# EAGLE design LogicShrimp-v1.0b (EAGLE 5.11)
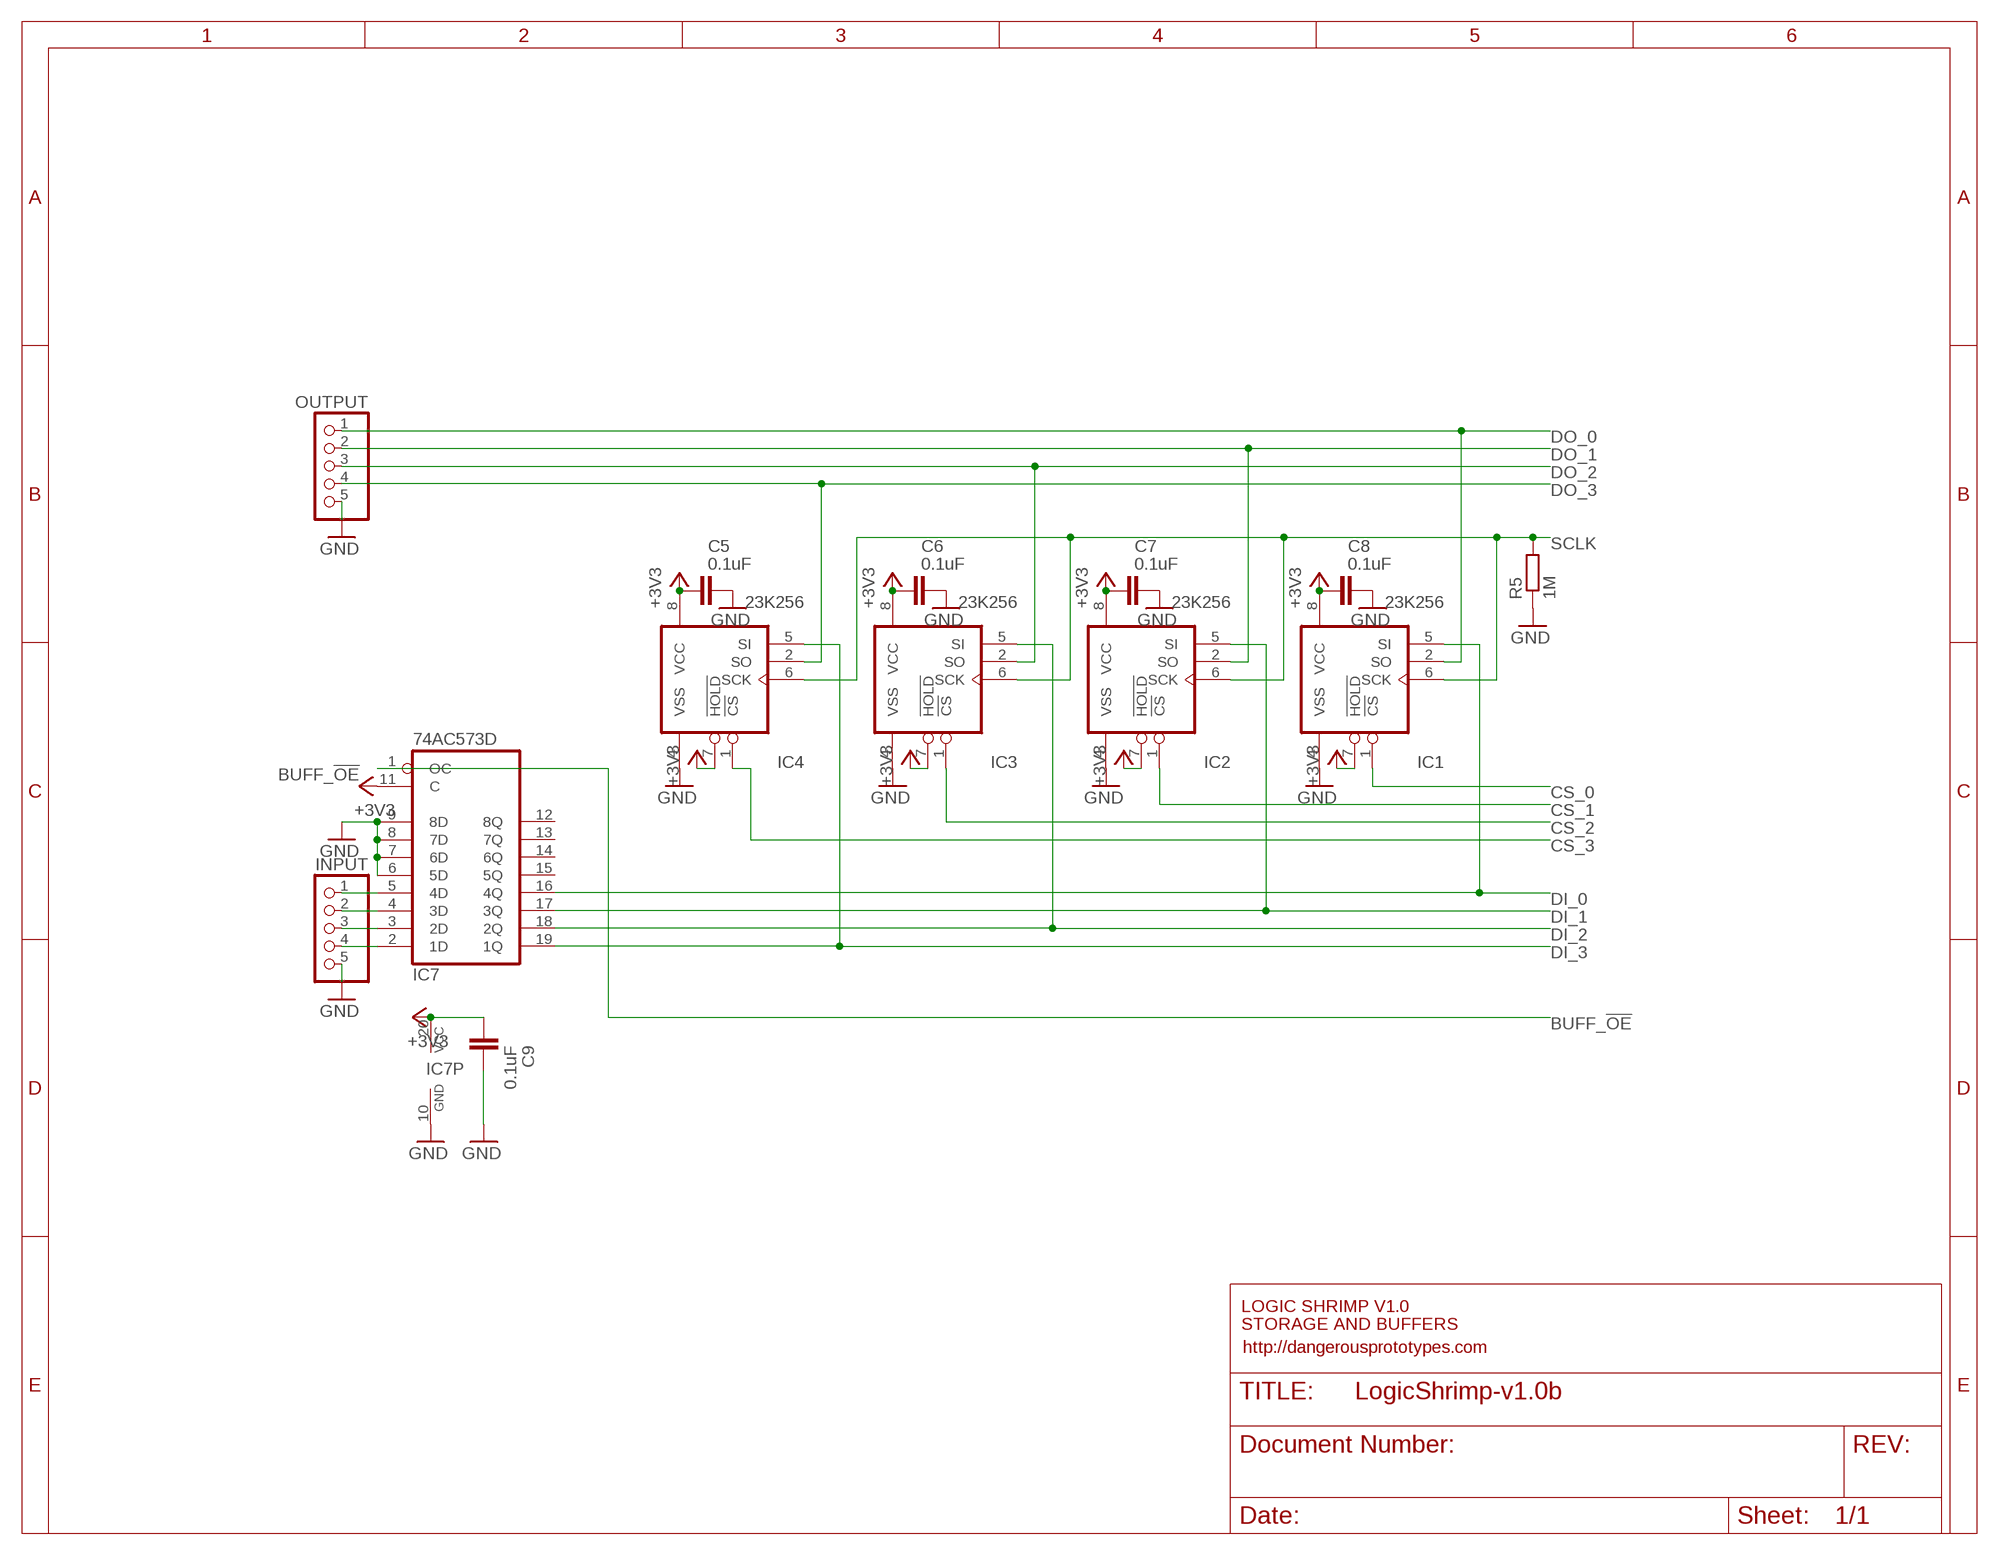
[diagram p0: schematic, sheet 1, part 1 of 2]
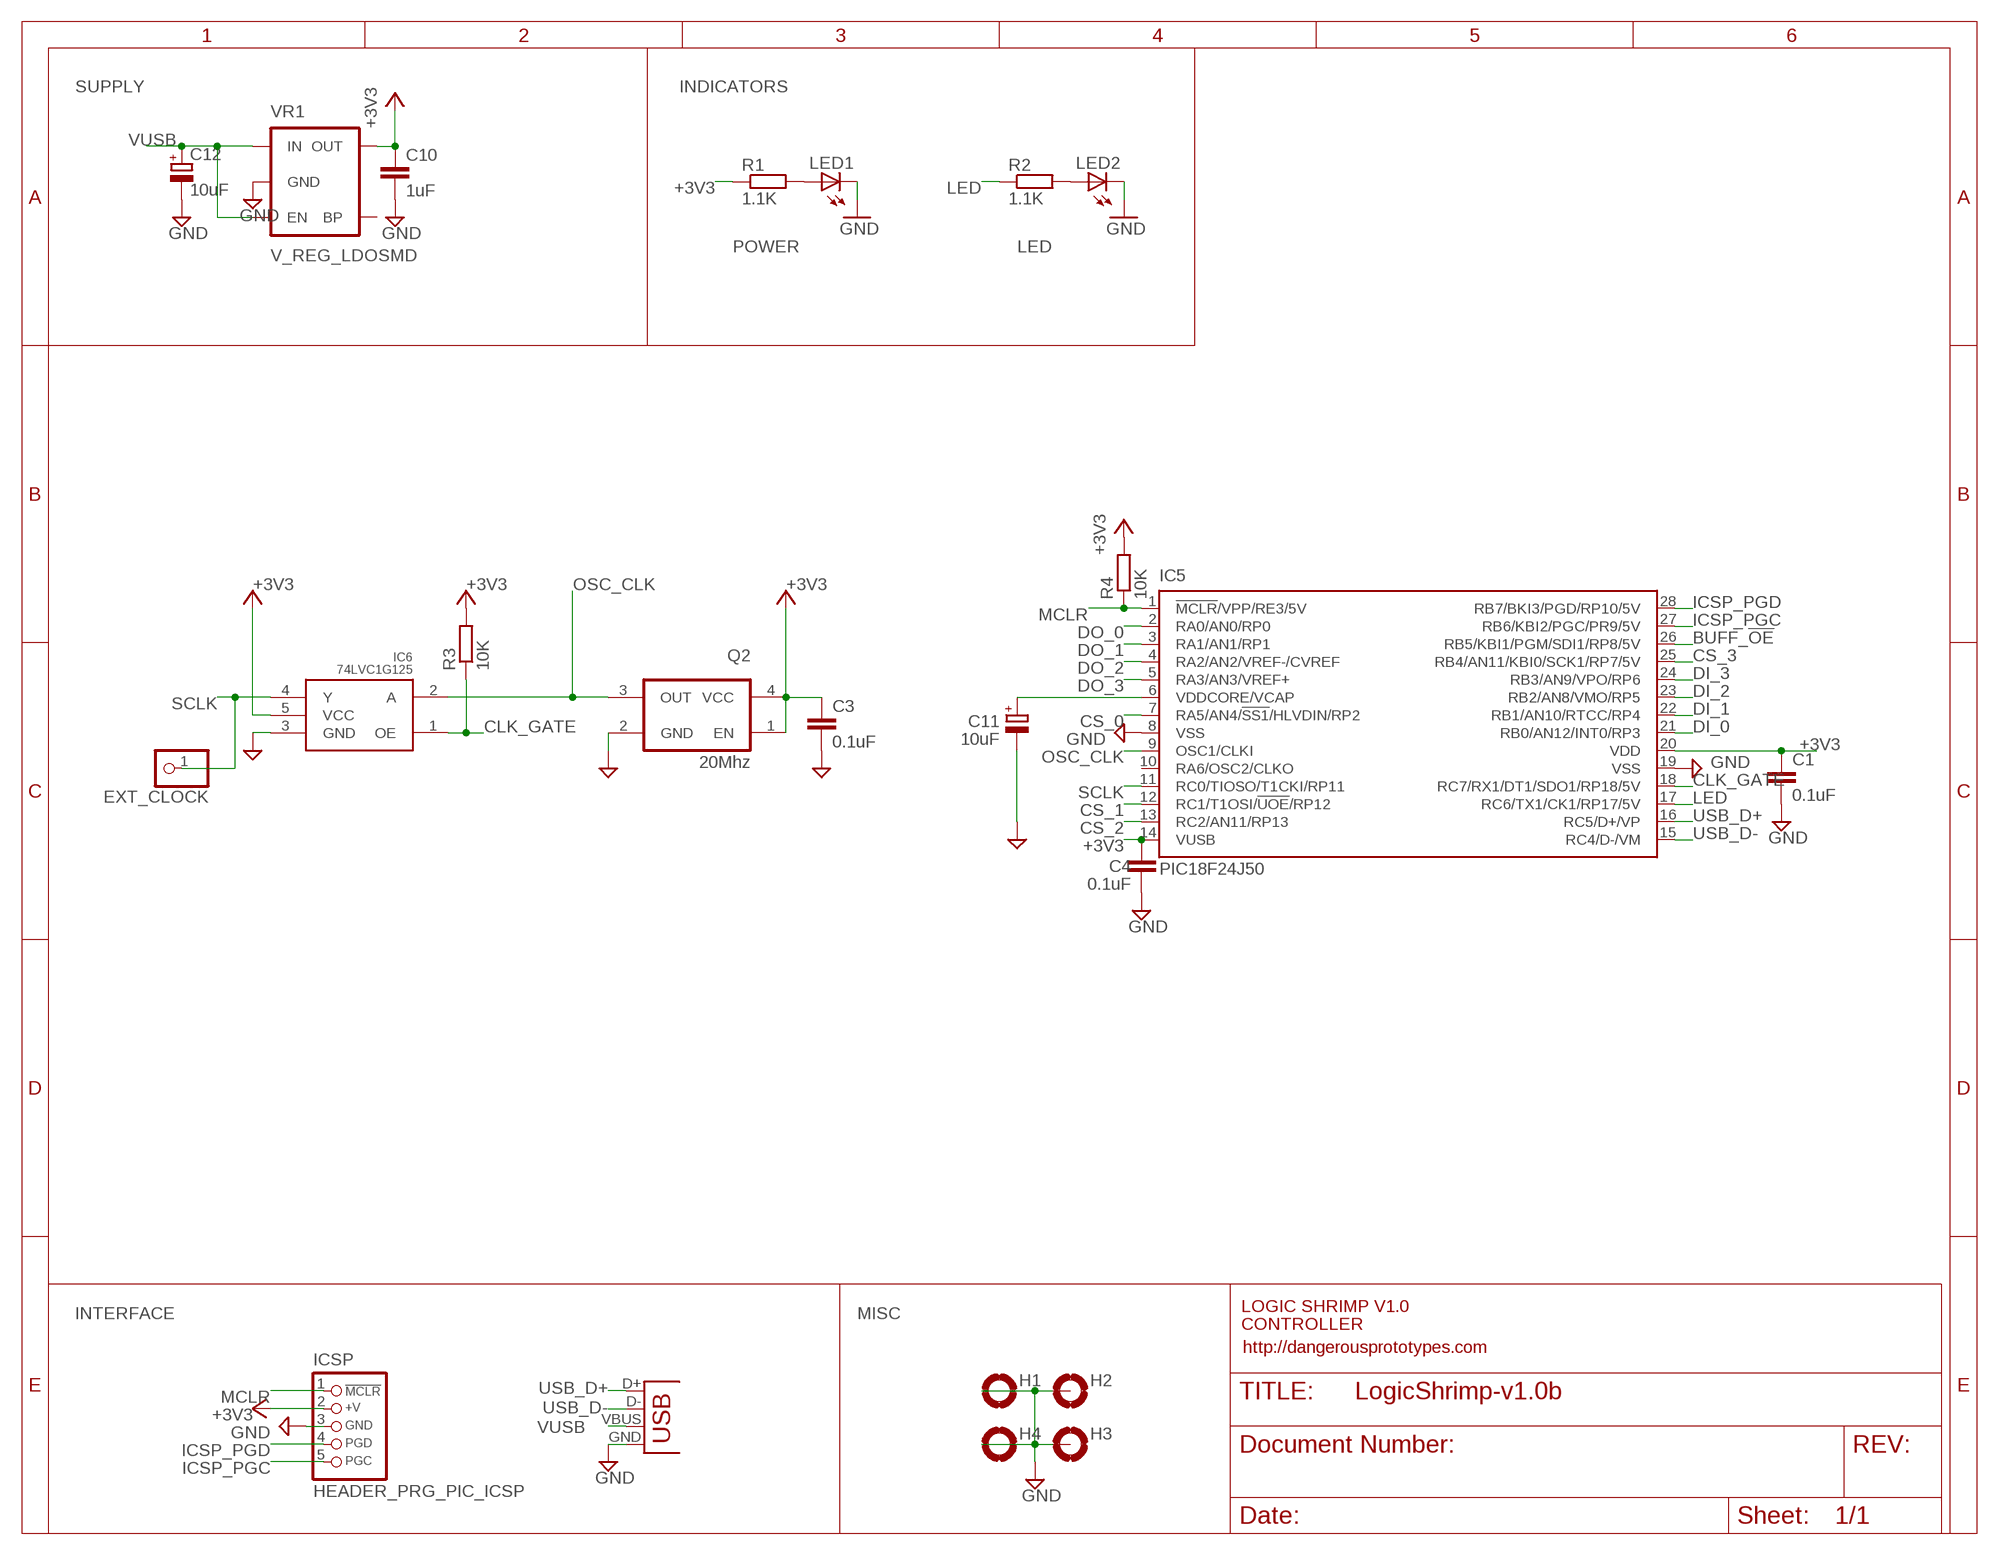
[diagram p1: schematic, sheet 1, part 2 of 2]

## Parts
C1  0.1uF  C-EUC0603  [C0603]
C3  0.1uF  C-EUC0603  [C0603]
C4  0.1uF  C-EUC0603  [C0603]
C5  0.1uF  C-EUC0603  [C0603]
C6  0.1uF  C-EUC0603  [C0603]
C7  0.1uF  C-EUC0603  [C0603]
C8  0.1uF  C-EUC0603  [C0603]
C9  0.1uF  C-EUC0603  [C0603]
C10  1uF  C-EUC0603  [C0603]
C11  10uF  CPOL-EUSMCA  [SMC_A]
C12  10uF  CPOL-EUSMCA  [SMC_A]
EXT_CLOCK  PINHD-1X1  [1X01]
H1  MOUNT-PAD-ROUND2.8  [2,8-PAD]
H2  MOUNT-PAD-ROUND2.8  [2,8-PAD]
H3  MOUNT-PAD-ROUND2.8  [2,8-PAD]
H4  MOUNT-PAD-ROUND2.8  [2,8-PAD]
IC1  23K256  [SOIC8]
IC2  23K256  [SOIC8]
IC3  23K256  [SOIC8]
IC4  23K256  [SOIC8]
IC5  PIC18F24J50  PIC18FJ2X50SSOP  [SSOP28]
IC6  74LVC1G125  [SOT-23-5]
IC7  74AC573D  [SO20W]
ICSP  HEADER_PRG_PIC_ICSP  [HEADER_PRG_1X05]
INPUT  PINHD-1X05_2.54-S  [1X05-S]
LED1  LED805  [LED-805]
LED2  LED805  [LED-805]
OUTPUT  PINHD-1X05_2.54-S  [1X05-S]
Q2  20Mhz  OSCILLATOR  [OSCILLATOR_7X5_SMD]
R1  1.1K  R-EU_R0603  [R0603]
R2  1.1K  R-EU_R0603  [R0603]
R3  10K  R-EU_R0603  [R0603]
R4  10K  R-EU_R0603  [R0603]
R5  1M  R-EU_R0603  [R0603]
USB  USBSMD  [USB-MINIB]
VR1  V_REG_LDOSMD  [SOT23-5]

## Nets
+3V3: C1.1 C3.1 C4.1 C5.1 C6.2 C7.2 C8.2 C9.1 C10.1 IC1.7(!HOLD) IC1.8(VCC) IC2.7(!HOLD) IC2.8(VCC) IC3.7(!HOLD) IC3.8(VCC) IC4.7(!HOLD) IC4.8(VCC) IC5.14(VUSB) IC5.20(VDD) IC6.5(VCC) IC7.11(C) IC7.20(VCC) ICSP.2(+V) Q2.1(EN) Q2.4(VCC) R1.1 R3.2 R4.2 VR1.5(OUT)
BUFF_!OE: IC5.26(RB5/KBI1/PGM/SDI1/RP8/5V) IC7.1(OC)
CLK_GATE: IC5.18(RC7/RX1/DT1/SDO1/RP18/5V) IC6.1(OE) R3.1
CS_0: IC1.1(!CS) IC5.7(RA5/AN4/!SS1!/HLVDIN/RP2)
CS_1: IC2.1(!CS) IC5.12(RC1/T1OSI/!UOE!/RP12)
CS_2: IC3.1(!CS) IC5.13(RC2/AN11/RP13)
CS_3: IC4.1(!CS) IC5.25(RB4/AN11/KBI0/SCK1/RP7/5V)
DI_0: IC1.5(SI) IC5.21(RB0/AN12/INT0/RP3) IC7.16(4Q)
DI_1: IC2.5(SI) IC5.22(RB1/AN10/RTCC/RP4) IC7.17(3Q)
DI_2: IC3.5(SI) IC5.23(RB2/AN8/VMO/RP5) IC7.18(2Q)
DI_3: IC4.5(SI) IC5.24(RB3/AN9/VPO/RP6) IC7.19(1Q)
DO_0: IC1.2(SO) IC5.2(RA0/AN0/RP0) OUTPUT.1
DO_1: IC2.2(SO) IC5.3(RA1/AN1/RP1) OUTPUT.2
DO_2: IC3.2(SO) IC5.4(RA2/AN2/VREF-/CVREF) OUTPUT.3
DO_3: IC4.2(SO) IC5.5(RA3/AN3/VREF+) OUTPUT.4
GND: C1.2 C3.2 C4.2 C5.2 C6.1 C7.1 C8.1 C9.2 C10.2 C11.- C12.- H1.B2,8(MOUNT) H2.B2,8(MOUNT) H3.B2,8(MOUNT) H4.B2,8(MOUNT) IC1.4(VSS) IC2.4(VSS) IC3.4(VSS) IC4.4(VSS) IC5.8(VSS) IC5.19(VSS) IC6.3(GND) IC7.6(5D) IC7.7(6D) IC7.8(7D) IC7.9(8D) IC7.10(GND) ICSP.3(GND) INPUT.5 LED1.C LED2.C OUTPUT.5 Q2.2(GND) R5.1 USB.GND VR1.2(GND)
ICSP_PGC: IC5.27(RB6/KBI2/PGC/PR9/5V) ICSP.5(PGC)
ICSP_PGD: IC5.28(RB7/BKI3/PGD/RP10/5V) ICSP.4(PGD)
LED: IC5.17(RC6/TX1/CK1/RP17/5V) R2.1
MCLR: IC5.1(!MCLR!/VPP/RE3/5V) ICSP.1(/MCLR) R4.1
N$2: IC7.5(4D) INPUT.1
N$3: IC7.4(3D) INPUT.2
N$4: IC7.3(2D) INPUT.3
N$5: IC7.2(1D) INPUT.4
N$6: C11.+ IC5.6(VDDCORE/VCAP)
N$7: LED1.A R1.2
N$8: LED2.A R2.2
OSC_CLK: IC5.9(OSC1/CLKI) IC6.2(A) Q2.3(OUT)
SCLK: EXT_CLOCK.1 IC1.6(SCK) IC2.6(SCK) IC3.6(SCK) IC4.6(SCK) IC5.11(RC0/TIOSO/T1CKI/RP11) IC6.4(Y) R5.2
USB_D+: IC5.16(RC5/D+/VP) USB.D+
USB_D-: IC5.15(RC4/D-/VM) USB.D-
VUSB: C12.+ USB.VBUS VR1.1(IN) VR1.3(EN)
Unconnected: IC5.10(RA6/OSC2/CLKO) IC7.12(8Q) IC7.13(7Q) IC7.14(6Q) IC7.15(5Q) VR1.4(BP)

## Notes on the sheet
- SUPPLY | INDICATORS
- POWER | LED
- LOGIC SHRIMP V1.0 | LOGIC SHRIMP V1.0
- INTERFACE | MISC
- STORAGE AND BUFFERS | CONTROLLER
- http://dangerousprototypes.com | http://dangerousprototypes.com

## Library data of the parts
C1 C4 C10 = resistor:C-EU: CAPACITOR, European symbol
C3 C5-C9 = rcl:C-EU: CAPACITOR, European symbol
C11 C12 = rcl:CPOL-EU: POLARIZED CAPACITOR, European symbol
EXT_CLOCK = pinhead-2:PINHD-1X1: PIN HEADER
H1-H4 = holes:MOUNT-PAD-ROUND: MOUNTING PAD, round
IC1-IC4 = dp_devices:23K256: 256K SPI Bus Low power Serial SRAM
IC5 = dp_devices:PIC18FJ2X50; PIC18FJ2X50: PIC18FJ2X50
IC6 = dp_devices:74LVC1G125
IC7 = 74xx-eu:74*573: 8-bit D latch BUS DRIVER
ICSP = dp_devices:HEADER_PRG_PIC_ICSP: 5-pin PIC In Circuit Serial Programming header
INPUT OUTPUT = pinhead-2:PINHD-1X05: PIN HEADER
LED1 LED2 = dp_devices:LED
Q2 = dp_devices:OSCILLATOR: Oscillator
R1-R5 = resistor:R-EU_: RESISTOR, European symbol
USB = SparkFun:USB: USB Connectors USB-B-PTH is fully proven SKU : PRT-00139 USB-miniB is fully proven SKU : PRT-00587 USB-A-PCB is untested. USB-A-H is throughly reviewed, but untested. Spark Fun Electronics SKU : PRT-00437 USB-B-SMT is throughly reviewed, but untested. Needs silkscreen touching up. USB-A-S has not been used/tested USB-MB-H has not been used/tested
VR1 = SparkFun:V_REG_LDO: Voltage Regulator LDO Standard 150mA LDO voltage regulator in SOT-23 layout. Micrel part MIC5205. BP (by-pass) pin is used to lower output noise with 470pF cap.

## Board
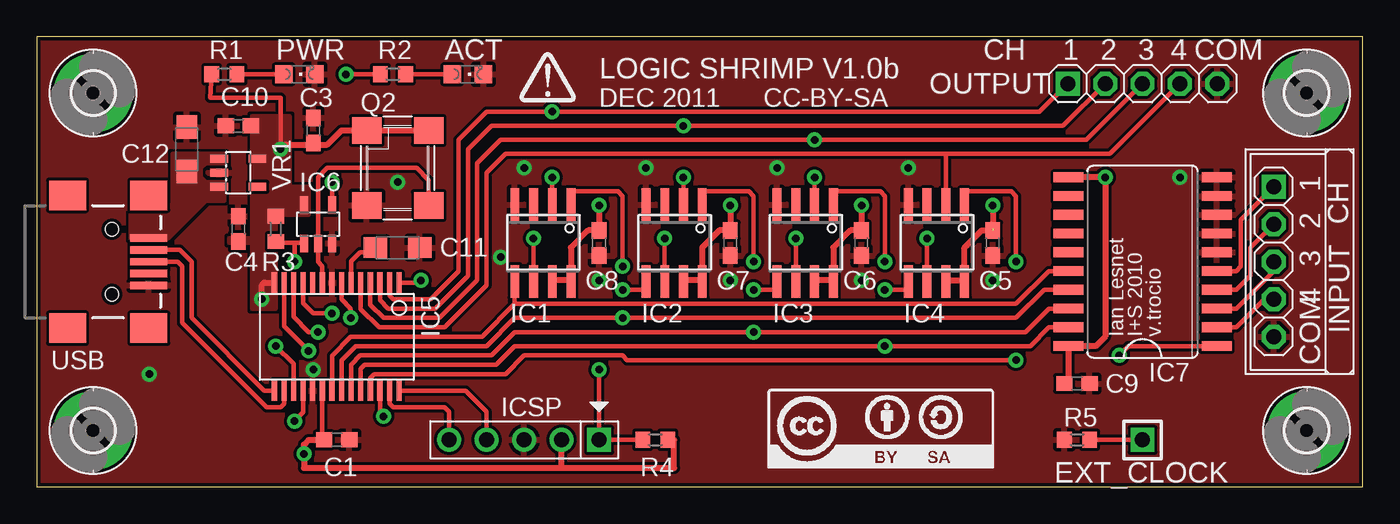
[diagram p2: board, top side]
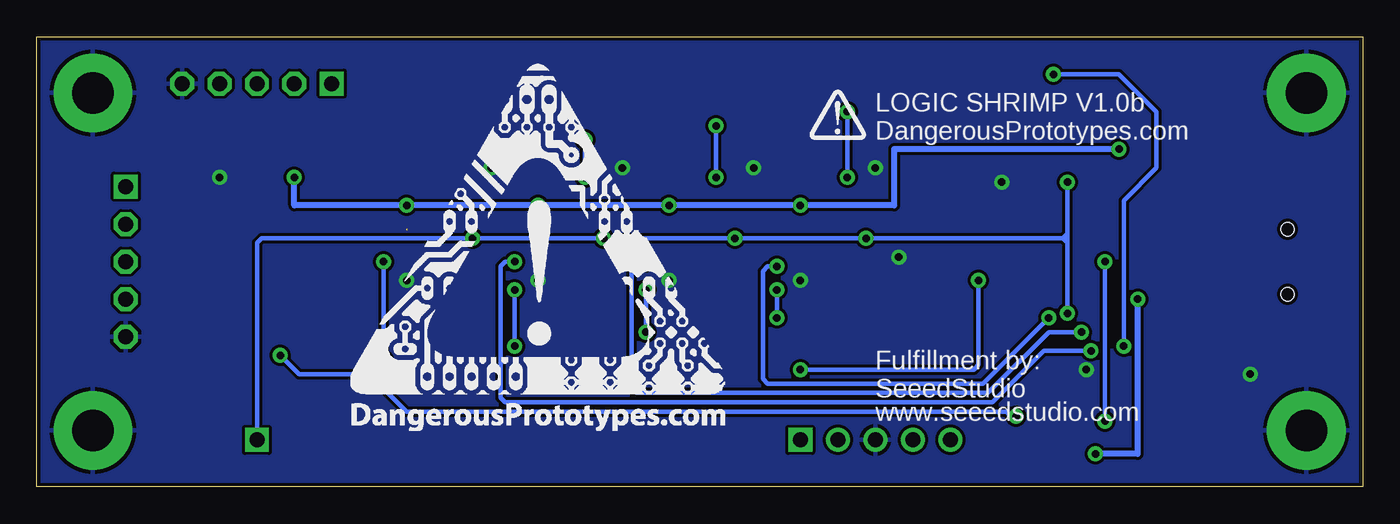
[diagram p3: board, bottom side, seen from below]

Size 89.84 x 30.47 mm. Coordinates in mm from the lower left corner, seen from the top.
Outline: 0,0 89.84,0 89.84,30.47 0,30.47 0,0
Copper layers (1*16): Top 0.035mm / dielectric 1.5mm / Bottom 0.035mm
Design rules "SparkFun": minimum track width 8mil, minimum drill 20mil, track to track 8mil, track to pad 8mil, pad to pad 8mil, via to via 8mil, smd to smd 8mil, copper to edge 10mil, drill to drill 8mil, minimum pad ring 12mil, minimum via ring 10mil, stop-mask expansion 4mil, vias tented up to drill 25mil, thermal gap 10mil

### Footprints (pad centres in the part's own frame; a part is rotated, then mirrored left to right if it is on the bottom)
C0603 = smd 1.1 x 1: 1 -0.85,0; 2 0.85,0
SMC_A = smd 1.6 x 1.4: + -1.5,0; - 1.5,0
1X01 = drill 1.016 square: 1 0,0
2,8-PAD = drill 2.8 pad 5.334 round: B2,8 0,0
SOIC8 = smd 0.6 x 2.2: 1 -1.905,-2.6; 2 -0.635,-2.6; 3 0.635,-2.6; 4 1.905,-2.6; 5 1.905,2.6; 6 0.635,2.6; 7 -0.635,2.6; 8 -1.905,2.6
SSOP28 = smd 0.348 x 1.397: 1 -4.225,-3.656; 2 -3.575,-3.656; 3 -2.925,-3.656; 4 -2.275,-3.656; 5 -1.625,-3.656; 6 -0.975,-3.656; 7 -0.325,-3.656; 8 0.325,-3.656; 9 0.975,-3.656; 10 1.625,-3.656; 11 2.275,-3.656; 12 2.925,-3.656; 13 3.575,-3.656; 14 4.225,-3.656; 15 4.225,3.656; 16 3.575,3.656; 17 2.925,3.656; 18 2.275,3.656; 19 1.625,3.656; 20 0.975,3.656; 21 0.325,3.656; 22 -0.325,3.656; 23 -0.975,3.656; 24 -1.625,3.656; 25 -2.275,3.656; 26 -2.925,3.656; 27 -3.575,3.656; 28 -4.225,3.656
SOT-23-5 = smd 0.55 x 1.2: 1 -0.95,-1.3; 2 0,-1.3; 3 0.95,-1.3; 4 0.95,1.3; 5 -0.95,1.3
SO20W = smd 0.66 x 2.032: 1 -5.715,-5.029; 2 -4.445,-5.029; 3 -3.175,-5.029; 4 -1.905,-5.029; 5 -0.635,-5.029; 6 0.635,-5.029; 7 1.905,-5.029; 8 3.175,-5.029; 9 4.445,-5.029; 10 5.715,-5.029; 11 5.715,5.029; 12 4.445,5.029; 13 3.175,5.029; 14 1.905,5.029; 15 0.635,5.029; 16 -0.635,5.029; 17 -1.905,5.029; 18 -3.175,5.029; 19 -4.445,5.029; 20 -5.715,5.029
HEADER_PRG_1X05 = drill 1.016 square: 1 -5.08,0 | drill 1.016 round: 2 -2.54,0; 3 0,0; 4 2.54,0; 5 5.08,0
1X05-S = drill 1.016 square: 1 -5.08,0 | drill 1.016 octagon: 2 -2.54,0; 3 0,0; 4 2.54,0; 5 5.08,0
LED-805 = smd 1.2 x 1.2: A 0,-1.05; C 0,1.05
OSCILLATOR_7X5_SMD = smd 1.8 x 2: 1 -2.54,-2.1; 2 2.54,-2.1; 3 2.54,2.1; 4 -2.54,2.1
R0603 = smd 1 x 1.1: 1 -0.85,0; 2 0.85,0
USB-MINIB = smd 2.5 x 0.5: D+ 2.5,0; D- 2.5,0.8; GND 2.5,-1.6; ID 2.5,-0.8; VBUS 2.5,1.6 | smd 2.5 x 2: GND@1 -3,-4.5; GND@2 -3,4.5; GND@3 2.5,4.5; GND@4 2.5,-4.5 | hole 0.9: 0,2.2; 0,-2.2
SOT23-5 = smd 0.55 x 1.2: 1 -0.95,-1.3; 2 0,-1.3; 3 0.95,-1.3; 4 0.95,1.3; 5 -0.95,1.3

### Placement (x,y rotation side)
C1  20.32,3.17 0 top
C3  18.73,24.13 90 top
C4  13.65,17.46 90 top
C5  64.77,16.51 270 top
C6  55.88,16.51 90 top
C7  46.99,16.51 90 top
C8  38.1,16.51 90 top
C9  70.48,6.99 0 top
C10  13.65,24.45 180 top
C11  24.45,16.19 0 top
C12  10.16,22.86 90 top
EXT_CLOCK  74.93,3.17 0 top
H1  3.81,26.67 0 top
H2  86.04,26.67 0 top
H3  86.04,3.81 0 top
H4  3.81,3.81 0 top
IC1  34.29,16.51 180 top
IC2  43.18,16.51 180 top
IC3  52.07,16.51 180 top
IC4  60.96,16.51 180 top
IC5  20.32,10.16 180 top
IC6  19.05,17.78 0 top
IC7  74.93,15.24 90 top
ICSP  33.02,3.17 180 top
INPUT  83.82,15.24 270 top
LED1  17.78,27.94 270 top
LED2  29.21,27.94 270 top
OUTPUT  74.93,27.3 0 top
Q2  24.45,21.59 270 top
R1  12.7,27.94 0 top
R2  24.13,27.94 0 top
R3  16.19,17.46 90 top
R4  41.91,3.17 0 top
R5  70.48,3.17 0 top
U$1  [DP-LOGO_TOP]  32.7,26.04 0 top
U$2  [DP-LOGO-BOTTOM]  33.66,23.49 0 top
U$3  [DP_LOGO_ART_1X1]  68.58,3.81 0 bottom
U$4  [CC-BY-SA]  49.53,1.27 0 top
USB  5.08,15.24 0 top
VR1  13.65,21.27 270 top

### Tracks (layer width: path | path; a pad name or v marks a point on that pad's centre or on a via)
+3V3  (via drill 0.51)  (1 unrouted)
  Top 0.305: IC5.20 19.34,3.3 C1.1 | R1.1 11.75,26.35 16.51,26.35 v16.51,22.86
  Top 0.406: Q2.4 Q2.1 20.64,24.13 19.68,23.18 18.84,23.18 C3.1 18.73,23.18 16.83,23.18 v16.51,22.86 | IC1.8 36.26,13.97 | 34.98,13.97 IC1.7 34.92,13.97 36.13,13.97 IC1.8 | IC2.7 43.81,13.97 45.02,13.97 | IC2.8 45.02,13.97 | IC2.8 45.15,13.97 45.02,13.97 | IC3.7 52.7,13.97 54.03,13.97 IC3.8 53.98,16.19 55.14,17.36 C6.2 v55.88,19.05 | IC4.7 61.59,13.97 62.8,13.97 | 62.8,13.97 IC4.8 | IC4.8 62.92,13.97 62.8,13.97 | IC5.14 15.4,13.82 15.24,13.65 v15.24,12.7 | C1.1 18.41,3.17 18.1,2.86 v18.1,2.22 18.1,1.27 35.56,1.27 | 35.56,1.27 ICSP.2 | R4.2 43.18,3.17 43.18,1.27 35.56,1.27 | IC1.8 36.2,13.97 | IC1.8 36.2,16.19 37.36,17.36 C8.2 v38.1,19.05 | v46.99,19.05 C7.2 46.25,17.36 45.09,16.19 IC2.8 | C5.1 64.03,17.36 62.87,16.19 IC4.8 | v64.77,19.05 64.77,17.46 | IC7.11 v72.39,20.95 72.39,10.16 71.75,9.52 IC7.20 69.9,7.25 C9.1
  Bottom 0.406: v72.39,20.95 72.39,19.05 v64.77,19.05 v55.88,19.05 v46.99,19.05 v38.1,19.05 31.75,19.05 31.75,22.86 v16.51,22.86 | v15.24,12.7 15.24,2.22 v18.1,2.22
  pour Top (no thermals): 14.61,25.08 17.14,25.08 17.14,20.32 18.41,20.32 18.41,18.41 16.19,18.41 16.19,12.06 14.61,12.06 14.61,16.51 13.02,16.51 13.02,16.83 14.61,16.83
BUFF_!OE  (via drill 0.51)
  Top 0.305: IC5.26 23.25,5.01 v23.5,4.76 | IC7.1 73.98,9.52 v73.34,8.89
  Bottom 0.305: v23.5,4.76 23.81,4.76 24.13,5.08 64.77,5.08 67.31,7.62 72.07,7.62 v73.34,8.89
CLK_GATE  (via drill 0.51)
  Top 0.305: IC6.1 18.05,16.43 18.05,16.46 18.1,16.51 17.46,16.51 | 17.46,16.51 16.51,16.51 R3.1 | IC5.18 18.05,5.03 v17.46,4.44 | v17.46,15.24 17.46,16.51
  Bottom 0.305: v17.46,4.44 v17.46,15.24
CS_0  (via drill 0.51)
  Top 0.305: 36.2,19.05 IC1.1 36.2,20 39.37,20 39.69,19.68 v39.69,14.92 | IC5.7 20.64,12.69 21.27,12.06 v21.27,11.43
  Bottom 0.305: v21.27,11.43 25.72,6.99 40.32,6.99 40.64,7.3 40.64,14.61 40.32,14.92 v39.69,14.92
CS_1  (via drill 0.51)
  Top 0.305: 45.09,19.05 IC2.1 45.09,20 48.26,20 48.58,19.68 v48.58,15.24 | IC5.12 17.39,11.5 18.41,10.48 v19.05,10.48
  Bottom 0.305: v19.05,10.48 21.27,10.48 25.4,6.35 49.21,6.35 49.53,6.67 49.53,14.92 49.21,15.24 v48.58,15.24
CS_2  (via drill 0.51)
  Top 0.305: 53.98,19.05 IC3.1 53.98,20 57.15,20 57.47,19.68 v57.47,15.24 | IC5.13 16.75,10.88 v18.41,9.21
  Bottom 0.305: v18.41,9.21 21.59,9.21 25.08,5.72 58.1,5.72 58.42,6.03 58.42,14.92 58.1,15.24 v57.47,15.24
CS_3  (via drill 0.51)
  Top 0.305: IC5.25 22.59,7.35 22.86,7.62 31.75,7.62 33.02,8.89 39.69,8.89 40.01,8.57 v66.36,8.57 | v66.36,15.24 66.36,19.68 66.04,20 62.87,20 IC4.1
  Bottom 0.305: v66.36,8.57 v66.36,15.24
DI_0
  Top 0.305: 32.38,12.38 IC1.5 | IC5.21 20,8.88 21.27,10.16 30.16,10.16 32.38,12.38 | 32.38,12.38 66.36,12.38 68.58,14.61 IC7.16
DI_1  (via drill 0.51)
  Top 0.305: v39.69,13.33 41.27,13.33 IC2.5 41.27,13.97 | IC5.22 20.64,8.58 21.59,9.52 30.48,9.52 32.38,11.43 v39.69,11.43 66.36,11.43 68.26,13.33 IC7.17
  Bottom 0.305: v39.69,11.43 v39.69,13.33
DI_2  (via drill 0.51)
  Top 0.305: v48.58,13.33 50.16,13.33 IC3.5 | IC5.23 21.3,8.28 21.91,8.89 30.8,8.89 32.38,10.48 v48.58,10.48 66.99,10.48 68.58,12.06 IC7.18
  Bottom 0.305: v48.58,10.48 v48.58,13.33
DI_3  (via drill 0.51)
  Top 0.305: v57.47,13.33 59.05,13.33 IC4.5 | IC5.24 21.95,7.98 22.23,8.25 31.11,8.25 32.38,9.52 v57.47,9.52 67.31,9.52 68.58,10.79 IC7.19
  Bottom 0.305: v57.47,9.52 v57.47,13.33
DO_0  (via drill 0.51)
  Top 0.305: v34.92,20.95 IC1.2 | IC5.2 23.89,12.93 24.13,12.7 26.67,12.7 28.57,14.61 28.57,23.49 30.48,25.4 v34.92,25.4 67.94,25.4 OUTPUT.1
  Bottom 0.305: v34.92,25.4 v34.92,20.95
DO_1  (via drill 0.51)
  Top 0.305: v43.81,20.95 IC2.2 | IC5.3 23.25,12.63 23.81,12.06 26.99,12.06 29.21,14.29 29.21,22.86 30.8,24.45 v43.81,24.45 69.53,24.45 OUTPUT.2
  Bottom 0.305: v43.81,24.45 v43.81,20.95
DO_2  (via drill 0.51)
  Top 0.305: v52.7,20.95 IC3.2 | IC5.4 22.59,12.33 23.5,11.43 27.3,11.43 29.84,13.97 29.84,21.91 31.43,23.49 v52.7,23.49 71.12,23.49 OUTPUT.3
  Bottom 0.305: v52.7,23.49 v52.7,20.95
DO_3
  Top 0.305: 61.59,22.54 IC4.2 | IC5.5 21.95,12.03 23.18,10.79 27.62,10.79 30.48,13.65 30.48,21.27 31.75,22.54 61.59,22.54 | 61.59,22.54 72.71,22.54 OUTPUT.4
GND  (via drill 0.51)
  other vias: 31.43,15.56 18.73,7.94 38.1,13.97 46.99,13.97 64.77,13.97 55.88,13.97 24.45,20.64 7.62,7.62 33.02,21.59 41.27,21.59 50.16,21.59 59.05,21.59 77.47,20.95
  pour Top (rank 6): 0,30.48 90.17,30.48 90.17,0 0,0
  pour Bottom (rank 6): 0,30.48 90.17,30.48 90.17,0 0,0
ICSP_PGC
  Top 0.305: IC5.27 23.89,5.63 24.13,5.4 27.62,5.4 27.94,5.08 ICSP.5
ICSP_PGD
  Top 0.305: IC5.28 29.06,6.5 30.48,5.08 ICSP.4
LED  (via drill 0.51)
  Top 0.305: IC5.17 17.39,8.32 v16.19,9.52 | v20.95,27.94 R2.1
  Bottom 0.305: v20.95,27.94 16.51,27.94 13.97,25.4 13.97,21.59 16.19,19.37 v16.19,9.52
MCLR  (via drill 0.51)
  Top 0.305: R4.1 ICSP.1 v38.1,7.94 | IC5.1 25.88,13.82 v26.04,13.97
  Bottom 0.305: v26.04,13.97 26.04,8.25 26.35,7.94 v38.1,7.94
N$2
  Top 0.305: INPUT.1 81.6,18.1 81.6,14.92 81.28,14.61 IC7.5
N$3
  Top 0.305: INPUT.2 82.23,16.19 82.23,14.29 81.28,13.33 IC7.4
N$4
  Top 0.305: INPUT.3 83.82,14.61 81.28,12.06 IC7.3
N$5
  Top 0.305: INPUT.4 83.19,12.7 81.28,10.79 IC7.2
N$6
  Top 0.305: IC5.6 21.3,15.26 21.91,15.88 22.63,15.88 C11.+
N$7
  Top 0.305: R1.2 LED1.A
N$8
  Top 0.305: R2.2 LED2.A
OSC_CLK
  Top 0.305: Q2.3 26.55,20.76 25.72,21.59 19.68,21.59 19.05,20.95 IC6.2 19.05,15.24 19.34,14.95 IC5.9
SCLK  (via drill 0.51)
  Top 0.305: v33.66,16.83 IC1.6 | v42.55,16.83 IC2.6 | v51.44,16.83 IC3.6 | v60.33,16.83 IC4.6 | IC6.4 20,20.32 v20,20.64 | EXT_CLOCK.1 R5.2 | v20,11.75 18.73,11.75 18.05,12.43 IC5.11
  Bottom 0.305: 20,16.83 20.32,16.83 | 20.32,16.83 v33.66,16.83 v42.55,16.83 v51.44,16.83 v60.33,16.83 74.61,16.83 74.93,16.51 EXT_CLOCK.1 | 20,16.83 20,17.14 | 20,17.14 v20,20.64 | v20,11.75 20,16.51 | 20,16.51 20,16.83 | 20.32,16.83 20,17.14 | 20,16.51 20.32,16.83
USB_D+
  Top 0.305: IC5.16 16.75,5.63 16.51,5.4 15.56,5.4 9.84,11.11 9.84,14.92 9.53,15.24 USB.D+
USB_D-
  Top 0.305: USB.D- 9.68,16.04 10.48,15.24 10.48,11.43 15.4,6.5 IC5.15 16.09,6.76
VUSB
  pour Top (no thermals): 6.35,16.83 6.35,19.05 9.21,19.05 9.21,22.54 12.7,22.54 12.7,21.91 11.43,21.91 11.11,21.59 11.11,20.95 11.43,20.64 12.7,20.64 12.7,19.37 11.43,19.37 8.89,16.83

### Text on the board
tPlace: PWR | ACT | CH | 1 | 2 | 3 | 4 | COM | LOGIC SHRIMP V1.0b | DEC 2011 | CC-BY-SA | 1 | 2 | CH | 3 | 4 | COM
tNames: Ian Lesnet | I+S 2010 | v.trocio
bNames: LOGIC SHRIMP V1.0b | DangerousPrototypes.com | Fulfillment by: | SeeedStudio | www.seeedstudio.com
Reference: LOGIC SHRIMP V1.0b | CC-BY-SA | Ian Lesnet 2011 | http://dangerousprototypes.com